# Altium schematic sheet auxiliary.SchDoc
size A3; SheetNumber: 3; SheetTotal: 6
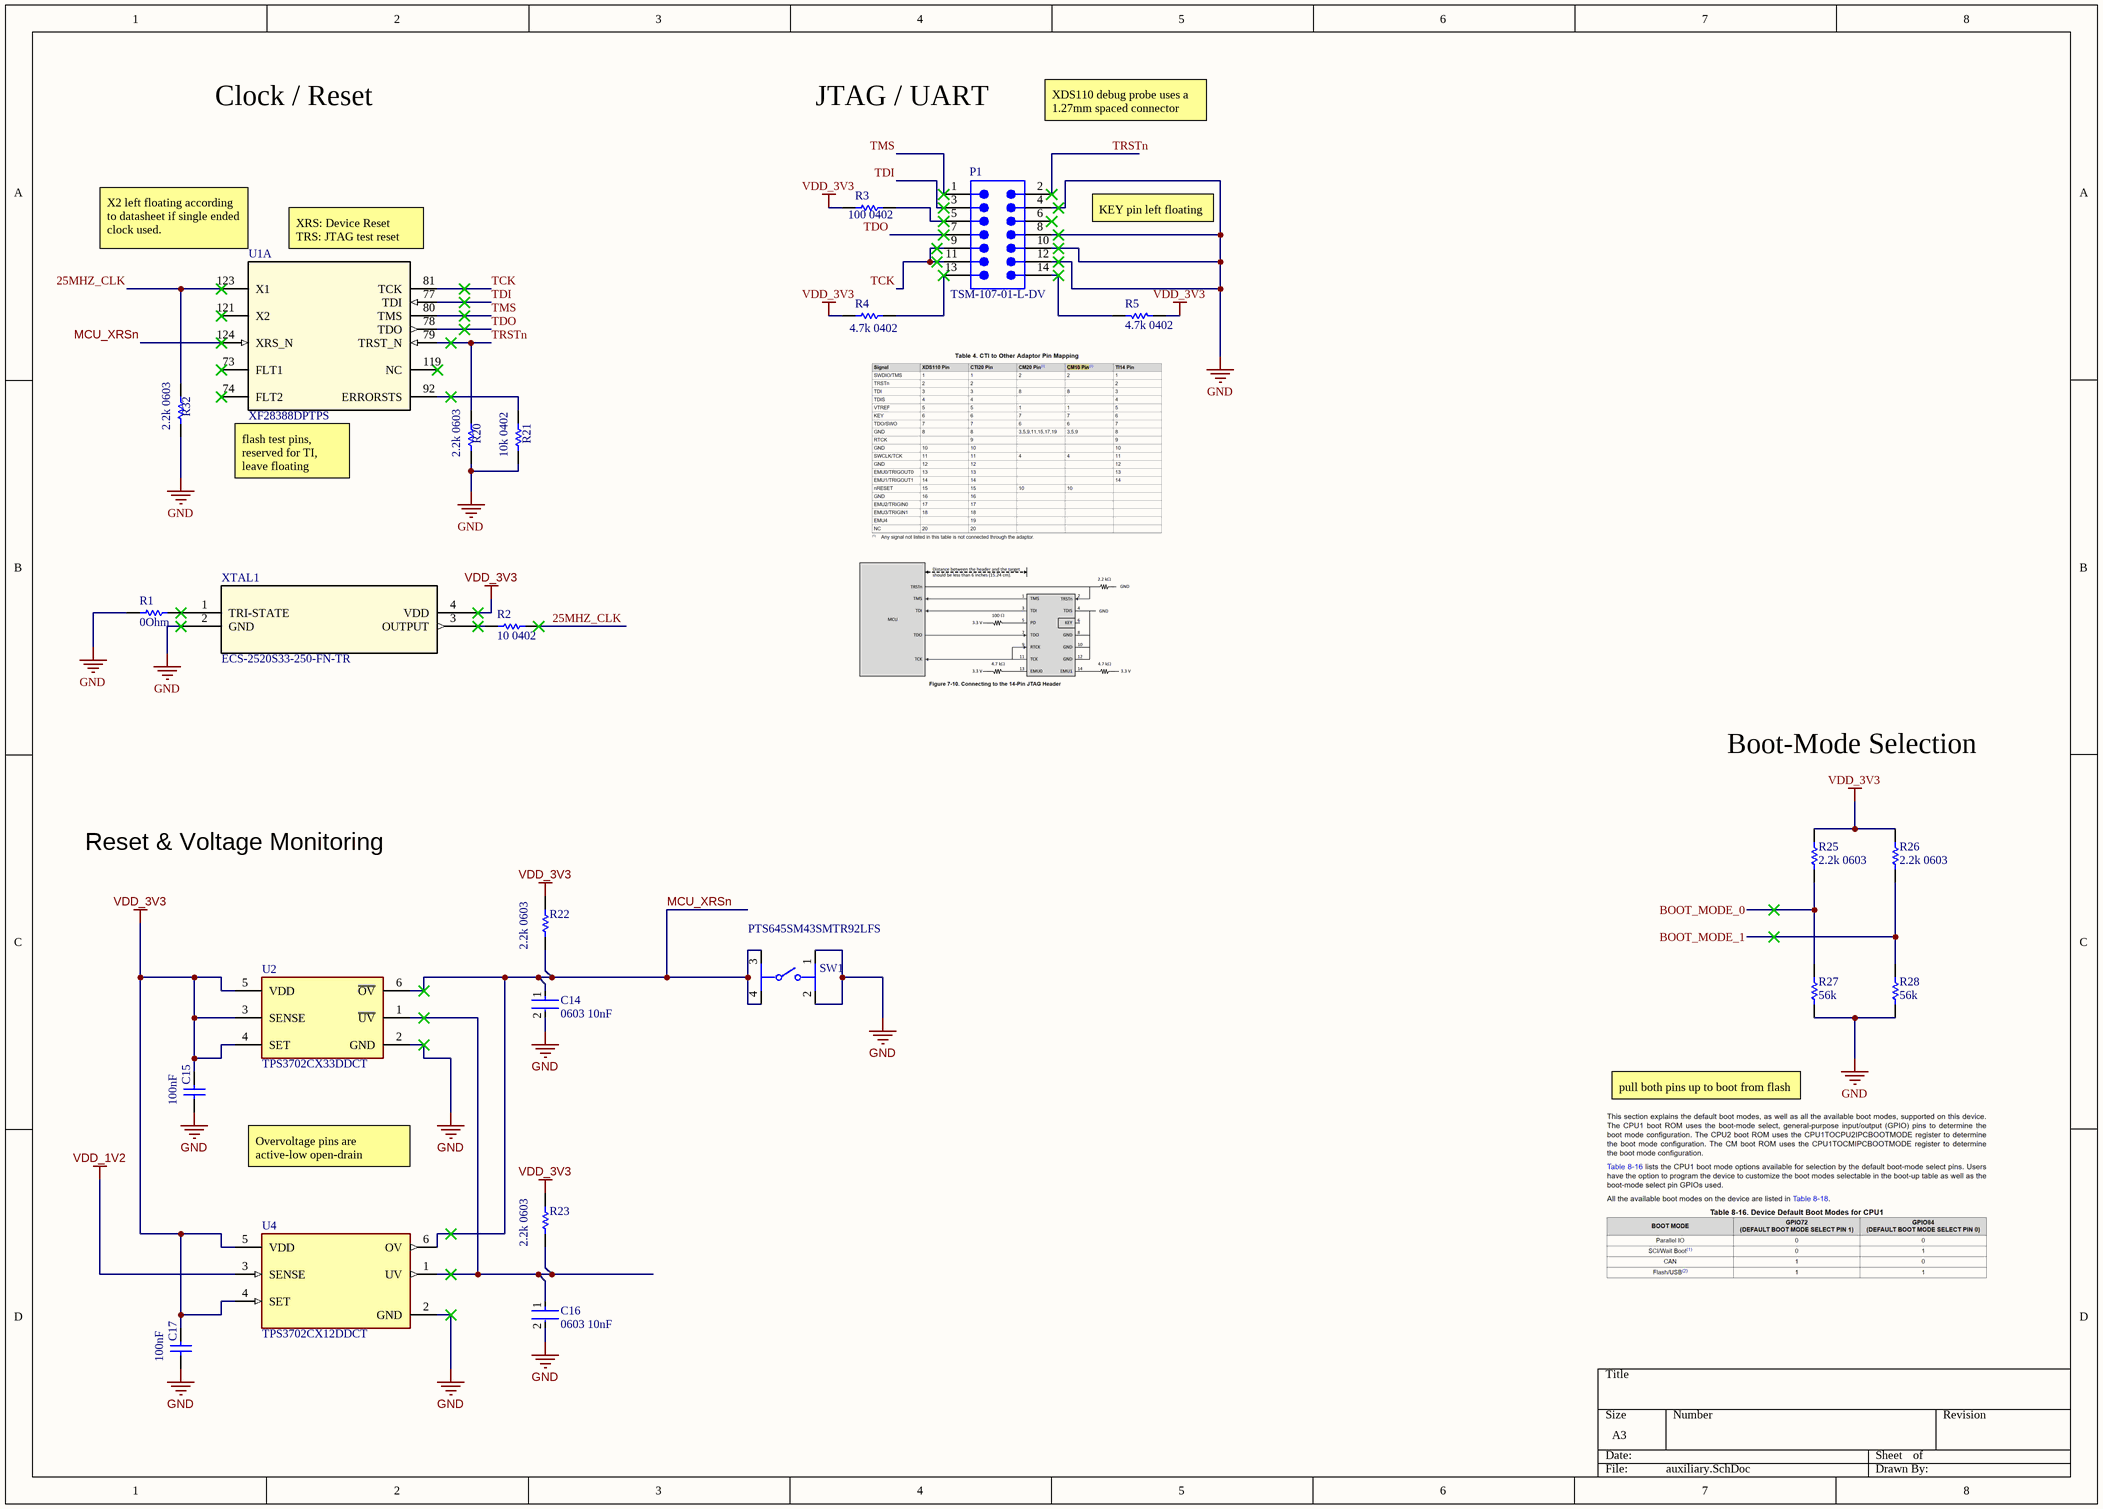
[diagram p0: auxiliary.SchDoc]

## Parts
C14  0603 10nF  [FP-CC0603-DA-MFG]
C15  100nF  [CAP 0402_1005]
C16  0603 10nF  [FP-CC0603-DA-MFG]
C17  100nF  [CAP 0402_1005]
P1  TSM-107-01-L-DV  [SMTC-TSM-107-01-X-DV]
R1  0Ohm  [RES 0603_1608]
R2  10 0402  [RES 0402_1005]
R3  100 0402  [RES 0603_1608]
R4  4.7k 0402  [RES 0603_1608]
R5  4.7k 0402  [RES 0603_1608]
R20  2.2k 0603  [RES 0603_1608]
R21  10k 0402  [RES 0402_1005]
R22  2.2k 0603  [RES 0603_1608]
R23  2.2k 0603  [RES 0603_1608]
R25  2.2k 0603  [RES 0603_1608]
R26  2.2k 0603  [RES 0603_1608]
R27  56k  [RES 0603_1608]
R28  56k  [RES 0603_1608]
R32  2.2k 0603  [RES 0603_1608]
SW1  PTS645SM43SMTR92LFS  [FP-PTS645SM43SMTR92LFS-MFG]
U1  XF28388DPTPS  [PTP0176F-IPC_A]  (part A of 5)
U2  TPS3702CX33DDCT  [FP-DDC0006A-IPC_B]
U4  TPS3702CX12DDCT  [FP-DDC0006A-IPC_C]
XTAL1  ECS-2520S33-250-FN-TR  [ECS-2520S_ECS]

## Nets
GND: C14.2 C15.1 C16.2 C17.1 P1.4 P1.8 P1.10 P1.12 R1.1 R20.1 R21.1 R27.1 R28.1 R32.1 SW1.1 SW1.2 U2.2(GND) U4.2(GND) XTAL1.2(GND)
VDD_1V2: U4.3(SENSE)
VDD_3V3: C15.2 C17.2 R3.2 R4.2 R5.2 R22.2 R23.2 R25.2 R26.2 U2.3(SENSE) U2.4(SET) U2.5(VDD) U4.4(SET) U4.5(VDD) XTAL1.4(VDD)
25MHZ_CLK: R2.1 R32.2 U1.123(X1)
BOOT_MODE_0: R25.1 R27.2
BOOT_MODE_1: R26.1 R28.2
MCU_XRSn: C14.1 R22.1 SW1.3 SW1.4 U1.124(XRS_N) U2.6(~{OV}) U4.6(OV)
TCK: P1.9 P1.11 U1.81(TCK)
TDI: P1.3 U1.77(TDI)
TDO: P1.7 U1.78(TDO)
TMS: P1.1 U1.80(TMS)
TRSTn: P1.2 R20.2 U1.79(TRST_N)
NetC16_1: C16.1 R23.1 U2.1(~{UV}) U4.1(UV)
NetP1_5: P1.5 R3.1
NetP1_13: P1.13 R4.1
NetP1_14: P1.14 R5.1
NetR1_2: R1.2 XTAL1.1(TRI-STATE)
NetR2_2: R2.2 XTAL1.3(OUTPUT)
NetR21_2: R21.2 U1.92(ERRORSTS)

Not connected (* = marked no-connect by the designer): P1 6*; U1 73(FLT1)* 74(FLT2)* 119(NC)* 121(X2)*

## Notes on the sheet
- Clock / Reset
- JTAG / UART
- XDS110 debug probe uses a 1.27mm spaced connector
- (near U1) X2 left floating according to datasheet if single ended clock used.
- (near U1) XRS: Device Reset
  TRS: JTAG test reset
- KEY pin left floating
- (near U1) flash test pins, reserved for TI, leave floating
- Boot-Mode Selection
- Reset & Voltage Monitoring
- pull both pins up to boot from flash
- Overvoltage pins are active-low open-drain

## Library data of the parts
C14 C16 = CMP-2100-03600-2: CAP CER 10000PF 50V X7R 0603 / CC0603KRX7R9BB103; Manufacturer: YAGEO; Tolerance: 0.1; Material: Ceramic; Temperature Coefficient: 15%; Mouser Description: Multilayer Ceramic Capacitor, CC Series, 0.01 - F, - 10%, X7R, 50 V, 0603 [1608 Metric]; Digikey Description: CAP CER 10000PF 50V X7R 0603; Height: 0.9mm; Category: Cap; Temperature Characteristic: X7R; Footprint Url: http://www.yageo.com/exep/pages/download/literatures/UPY-C_GEN_24.pdf; Lead Free: Yes; Voltage Rating: 50 V; Manufacturer Part Number: CC0603KRX7R9BB103; Temperature: -55°C to +125°C; Device Class L3: Ceramic Capacitors; ComponentLink2Description: Datasheet; Voltage: 50 V; Package: CC0603-DA; Octopart: https://octopart.com/cc0603krx7r9bb103-yageo-192938; Automotive: No; Temperature Range High: +125°C; Temperature Range Low: -55°C; Value: 10 nF; RoHS: TRUE; Device Class L1: Passive Components; ComponentLink2URL: http://www.yageo.com/documents/recent/UPY-GPHC_X7R_6.3V-to-50V_18.pdf; Device Class L2: Capacitors; Capacitance: 10 nF
C15 C17 = Cap: MLCC 100nF 0402 10V; Published: 8-Jun-2000; LatestRevisionDate: 17-Jul-2002; LatestRevisionNote: Re-released for DXP Platform.; PackageReference: RAD-0.3; Publisher: Altium Limited; PackageDescription: Radial Cap, Thru-Hole; 2 Leads; 0.3 in Pin Spacing; Value: 100nF; Supplier 1: Arrow Electronics; Supplier Part Number 1: C0402C104K8PACTU
P1 = CMP-1024-00260-1: 0.025" SQ Post Header, Surface Mount, Vertical, -55 to 125 degC, 2.54 mm Pitch, 14-Pin, Male, RoHS; Manufacturer: Samtec; Pitch: 2.54 mm; RoHS: True; PackageVersion: DJ, 4/1991; ComponentLink1Description: Manufacturer URL; ComponentLink3URL: http://www.samtec.com/documents/webfiles/cpdf/TSM-1XX-XX-XXX-XX-X-XXX-X-MKT.pdf; ComponentLink2Description: Datasheet; Orientation: Vertical; Mounting Technology: Surface Mount; ComponentLink2URL: http://www.samtec.com/documents/webfiles/pdf/TSM.PDF; PackageDescription: Double Row Gullwing ASM; DatasheetVersion: F-214; PackageReference: TSM-107-01-X-DV; ComponentLink1URL: http://www.samtec.com; ComponentLink3Description: Package Specification; PartNumber: TSM-107-01-L-DV; Temperature Range: -55 to 125 degC
R1 = Res1: Resistor 0Ohm 0603; Value: 22k; Published: 8-Jun-2000; LatestRevisionDate: 17-Jul-2002; LatestRevisionNote: Re-released for DXP Platform.; PackageReference: AXIAL-0.3; Publisher: Altium Limited; PackageDescription: Axial Device, Thru-Hole; 2 Leads; 0.3 in Pin Spacing; Supplier 1: Future Electronics; Supplier Part Number 1: 3992146
R2 = Res1: Resistor 10Ohm 0402; Value: 2.2k; Published: 8-Jun-2000; LatestRevisionDate: 17-Jul-2002; LatestRevisionNote: Re-released for DXP Platform.; PackageReference: AXIAL-0.3; Publisher: Altium Limited; PackageDescription: Axial Device, Thru-Hole; 2 Leads; 0.3 in Pin Spacing; Supplier 1: Arrow Electronics; Supplier Part Number 1: ERJ-2RKF10R0X
R3 = Res1: Resistor 100Ohm 0402; Value: 100; Published: 8-Jun-2000; LatestRevisionDate: 17-Jul-2002; LatestRevisionNote: Re-released for DXP Platform.; PackageReference: AXIAL-0.3; Publisher: Altium Limited; PackageDescription: Axial Device, Thru-Hole; 2 Leads; 0.3 in Pin Spacing; Supplier 1: Arrow Electronics; Supplier Part Number 1: ERJ-2RKF1000X
R4 R5 = Res1: Resistor 4.7kOhm 0402; Published: 8-Jun-2000; LatestRevisionDate: 17-Jul-2002; LatestRevisionNote: Re-released for DXP Platform.; PackageReference: AXIAL-0.3; Publisher: Altium Limited; PackageDescription: Axial Device, Thru-Hole; 2 Leads; 0.3 in Pin Spacing; Value: 4.7k
R20 R22 R23 R25 R26 R32 = Res1: Resistor 2.2kOhm 0603; Published: 8-Jun-2000; LatestRevisionDate: 17-Jul-2002; LatestRevisionNote: Re-released for DXP Platform.; PackageReference: AXIAL-0.3; Publisher: Altium Limited; PackageDescription: Axial Device, Thru-Hole; 2 Leads; 0.3 in Pin Spacing; Value: 2.2k
R21 = Res1: Resistor 10kOhm 0402; Published: 8-Jun-2000; LatestRevisionDate: 17-Jul-2002; LatestRevisionNote: Re-released for DXP Platform.; PackageReference: AXIAL-0.3; Publisher: Altium Limited; PackageDescription: Axial Device, Thru-Hole; 2 Leads; 0.3 in Pin Spacing; Value: 10k
R27 R28 = Res1: Resistor 56kOhm 0603; Published: 8-Jun-2000; LatestRevisionDate: 17-Jul-2002; LatestRevisionNote: Re-released for DXP Platform.; PackageReference: AXIAL-0.3; Publisher: Altium Limited; PackageDescription: Axial Device, Thru-Hole; 2 Leads; 0.3 in Pin Spacing; Value: 56k
SW1 = CMP-2000-05160-2: SWITCH TACTILE SPST-NO 0.05A 12V; Contact Resistance: 100mR; Throw Configuration: SPST; Illumination Type: Non-Illuminated; Mechanical Life: 100000Cycles; Current Rating: 50mA; Switch Function: Off-Mom; Actuator Length: 0.85mm; Actuator Material: Nylon; Actuator Type: Standard; Operating Force: 160gf; Min Operating Temperature: -20°C; REACH SVHC: No SVHC; Termination: Gull Wing; Case/Package: SMD/SMT; Packaging: Tape and Reel; Mount: Surface Mount; Voltage Rating (DC): 12V; Orientation: Straight; Lead Free: Lead Free; Contact Material: Silver; Color: Black; Max Current Rating: 50mA; Contact Plating: Silver; Depth: 9mm; Package Quantity: 1; Max Voltage Rating (DC): 12V; Length: 6mm; Max Operating Temperature: 60°C
U1 = XF28388DPTPS: Mfr_Name: Texas Instruments; TYPE: TYPE; RefDes: RefDes; Supplier 1: Mouser; Supplier Part Number 1: 595-F28388DPTPS
U2 = CMP-04919-000019-1: IC SUPERVISOR 1 CHANNEL TSOT23-6; Operating Supply Current: 7uA; Quiescent Current: 6uA; Max Supply Voltage: 18V; Min Supply Voltage: 2V; Threshold Voltage: 3.3V; Undervoltage Threshold: 3.17V; Overvoltage Threshold: 3.6V; Number of Monitored Inputs: 1; Reset: Active Low; Accuracy: 0.25%; Package Quantity: 250; Weight: 0.001058oz; RoHS Compliant: Yes; Type: Voltage Detector; REACH SVHC: No SVHC; Number of Pins: 6; Min Operating Temperature: -40°C; Lead Free: Lead Free; Mount: Surface Mount; Case/Package: SOT-6; Max Operating Temperature: 125°C; Number of Voltages Monitored: 1; Packaging: Tape and Reel
U4 = CMP-04919-000022-1: IC SUPERVISOR 1 CHANNEL TSOT23-6; Reset: Active Low; Quiescent Current: 6uA; Threshold Voltage: 1.2V; Number of Voltages Monitored: 1; Max Supply Voltage: 18V; Min Supply Voltage: 2V; Lead Free: Lead Free; Number of Pins: 6; Mount: Surface Mount; Case/Package: SOT-23-6; Type: Voltage Detector; Max Operating Temperature: 125°C; REACH SVHC: No SVHC; Min Operating Temperature: -40°C; Packaging: Cut Tape; RoHS Compliant: Yes
XTAL1 = ECS-2520S33-250-FN-TR: 25MHz Oscillator; Mfr_Name: ECS International; RefDes: RefDes; Type: Type; Supplier 1: Digikey; Supplier Part Number 1: XC2198CT-ND